# Altium schematic sheet Power Delivery.SchDoc: Power Delivery
size A4; Engineer: Jouveer Naidoo; DocumentNumber: 3; Revision: 1; SheetNumber: 5; SheetTotal: 5; SPICEModelCacheIVYGDNUI: <root> / <DocumentId>IVYGDNUI</DocumentId> / <CacheFrame Number="0"> / <Model Name="cap" Kind="MDL"> / <Text>*Default semiconductor capacitor / .MODEL CAP C()</Text> / </Model> / </CacheFrame> / </root>; ProjectIdentifier: Spin Up
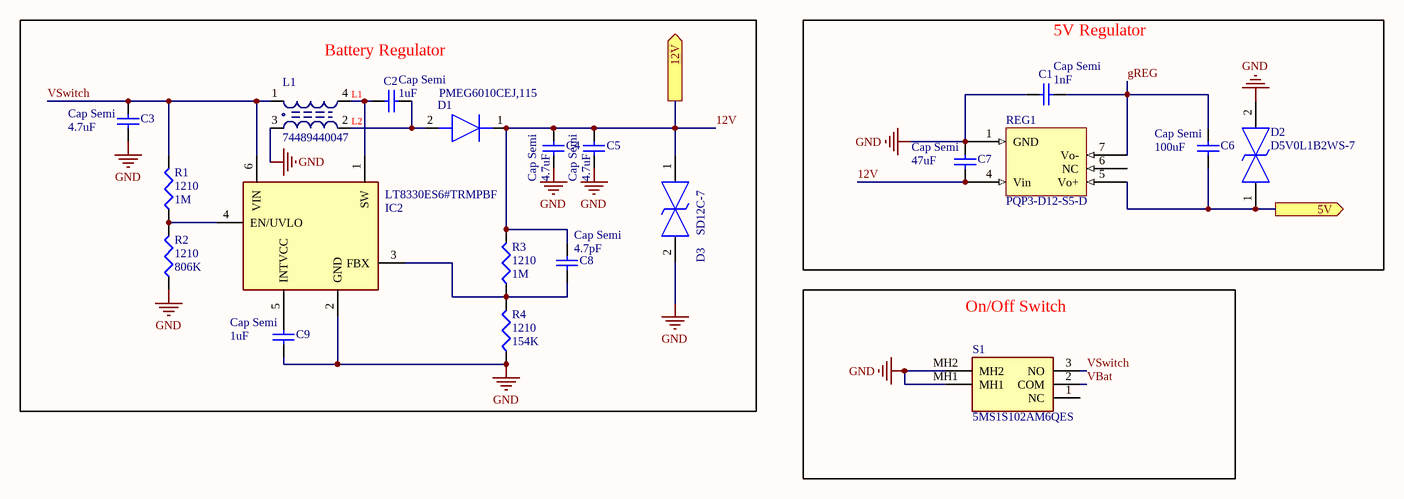
[diagram p0: Power Delivery.SchDoc]

## Parts
C1  Cap Semi  value 1nF  [C1210]
C2  Cap Semi  value 1uF  [C1210]
C3  Cap Semi  value 4.7uF  [C1210]
C4  Cap Semi  value 4.7uF  [C1210]
C5  Cap Semi  value 4.7uF  [C1210]
C6  Cap Semi  value 100uF  [C1210]
C7  Cap Semi  value 47uF  [C1210]
C8  Cap Semi  value 4.7pF  [C1210]
C9  Cap Semi  value 1uF  [C1210]
D1  PMEG6010CEJ,115  [SODFL2512X80N]
D2  D5V0L1B2WS-7  [D5V0L1B2WS7]
D3  SD12C-7  [SD12C7]
IC2  LT8330ES6#TRMPBF  [SOT95P280X100-6N]
L1  74489440047  [WE-TDC 8038]
R1  1210  value 1M  [14-1210]
R2  1210  value 806K  [14-1210]
R3  1210  value 1M  [14-1210]
R4  1210  value 154K  [14-1210]
REG1  PQP3-D12-S5-D  [PQP3-D12-S5-D-Footprint-1]
S1  5MS1S102AM6QES  [5MS1S102AM6QES]

## Blocks framed on the sheet
Battery Regulator: C2-C5 C8 C9 D1 D3 IC2 L1 R1-R4
5V Regulator: C1 C6 C7 D2 REG1
On/Off Switch: S1

## Ports
5V (out), 12V (out)

## Nets
GND: C1.1 C3.1 C4.1 C5.1 C7.2 C9.1 D2.2 D3.2 IC2.2(GND) L1.3 R2.1 R4.1 REG1.1(GND) S1.MH1 S1.MH2
5V: C6.1 D2.1 REG1.5(Vo+) ; port 5V
12V: C4.2 C5.2 C7.1 C8.2 D1.1(K) D3.1 R3.2 REG1.4(Vin) ; port 12V
gREG: C1.2 C6.2 REG1.7(Vo-)
VBat: S1.2(COM)
VSwitch: C3.2 IC2.6(VIN) L1.1 R1.2 S1.3(NO)
NetC2_1: C2.1 IC2.1(SW) L1.4
NetC2_2: C2.2 D1.2(A) L1.2
NetC8_1: C8.1 IC2.3(FBX) R3.1 R4.2
NetC9_2: C9.2 IC2.5(INTVCC)
NetIC2_4: IC2.4(EN/UVLO) R1.1 R2.2

Not connected (* = marked no-connect by the designer): REG1 6(NC); S1 1(NC)

## Notes on the sheet
- Size:
- Date:
- Title
- A4
- Project:
- Time:
- Revision:
- Sheet
- of
- Engineer
- File:
- (in symbol CMP-1402-00013-1) L2

## Library data of the parts
C1-C9 = Cap Semi: Capacitor (Semiconductor SIM Model); Published: 8-Jun-2000; LatestRevisionDate: 29-May-2009; LatestRevisionNote: IPC-7351 Footprint Added.; PackageReference: C1206; Publisher: Altium Limited; PackageDescription: Chip Capacitor
D1 = PMEG6010CEJ,115: Diode; Manufacturer_Name: Nexperia; Datasheet Link: https://assets.nexperia.com/documents/data-sheet/PMEG6010CEH_PMEG6010CEJ.pdf; Height: 0.8mm; Manufacturer_Part_Number: PMEG6010CEJ,115; Mouser Part Number: 771-PMEG6010CEJ-T/R; Mouser Price/Stock: https://www.mouser.co.uk/ProductDetail/Nexperia/PMEG6010CEJ115?qs=LOCUfHb8d9sJWWkUvN790w%3D%3D; Arrow Part Number: PMEG6010CEJ,115; Arrow Price/Stock: https://www.arrow.com/en/products/pmeg6010cej115/nexperia?region=nac
D2 = D5V0L1B2WS-7: TVS Diode (Bi-directional); Manufacturer_Name: Diodes Inc.; Datasheet Link: https://www.diodes.com/assets/Datasheets/D5V0L1B2WS.pdf; Height: 1.2mm; Manufacturer_Part_Number: D5V0L1B2WS-7; Mouser Part Number: 621-D5V0L1B2WS-7; Mouser Price/Stock: https://www.mouser.co.uk/ProductDetail/Diodes-Incorporated/D5V0L1B2WS-7?qs=gfe7vQ8txpVauHZXjiZDzg%3D%3D; Arrow Part Number: D5V0L1B2WS-7; Arrow Price/Stock: https://www.arrow.com/en/products/d5v0l1b2ws-7/diodes-incorporated?region=nac
D3 = SD12C-7: TVS Diode (Bi-directional); Manufacturer_Name: Diodes Inc.; Datasheet Link: https://www.diodes.com/assets/Datasheets/SD12C.pdf; Height: 1.2mm; Manufacturer_Part_Number: SD12C-7; Mouser Part Number: 621-SD12C-7; Mouser Price/Stock: https://www.mouser.co.uk/ProductDetail/Diodes-Incorporated/SD12C-7?qs=EBDBlbfErPxugjAb5VaoMA%3D%3D; Arrow Part Number: SD12C-7; Arrow Price/Stock: https://www.arrow.com/en/products/sd12c-7/diodes-incorporated?region=nac
IC2 = LT8330ES6#TRMPBF: Integrated Circuit; Manufacturer_Name: Analog Devices; Datasheet Link: http://www.linear.com/docs/46730; Height: 1mm; Manufacturer_Part_Number: LT8330ES6#TRMPBF; Mouser Part Number: 584-LT8330ES6#TRMPBF; Mouser Price/Stock: https://www.mouser.co.uk/ProductDetail/Analog-Devices/LT8330ES6TRMPBF?qs=oahfZPh6IAIKbCw%252BFEt3ng%3D%3D; Arrow Part Number: LT8330ES6#TRMPBF; Arrow Price/Stock: https://www.arrow.com/en/products/lt8330es6trmpbf/linear-technology
L1 = CMP-1402-00013-1: SMD Shielded Coupled Inductor WE-TDC, L=4.7 µH; Manufacturer: Wuerth Elektronik; Inductance: 4.7 ÂµH; ComponentLink2Description: Datasheet; PartNumber: 74489440047; PackageReference: WE-TDC 8038; ComponentLink1Description: Manufacturer URL; ComponentLink1URL: http://www.we-online.com; ComponentLink2URL: http://katalog.we-online.de/pbs/datasheet/74489440047.pdf
R1-R4 = Res3: Resistor; Published: 8-Jun-2000; LatestRevisionDate: 29-May-2009; LatestRevisionNote: IPC-7351 Footprint Added.; PackageReference: J1-0603; Publisher: Altium Limited; PackageDescription: Chip Resistor
REG1 = CMP-019-00049-2: Module DC-DC 12VIN 1-OUT 5V 0.6A 3W 5-Pin DIP Module Tube
S1 = 5MS1S102AM6QES: Switch; Manufacturer_Name: Dailywell; Datasheet Link: https://cz.mouser.com/datasheet/2/979/Dailywell_01132020_5M_Series-1708766.pdf; Height: 6.6mm; Manufacturer_Part_Number: 5MS1S102AM6QES; Mouser Part Number: 118-5MS1S102AM6QES; Mouser Price/Stock: https://www.mouser.co.uk/ProductDetail/Dailywell/5MS1S102AM6QES?qs=B6kkDfuK7%2FBHVJoQEkyphg%3D%3D